# Altium schematic sheet MotorDriver.SchDoc
size A
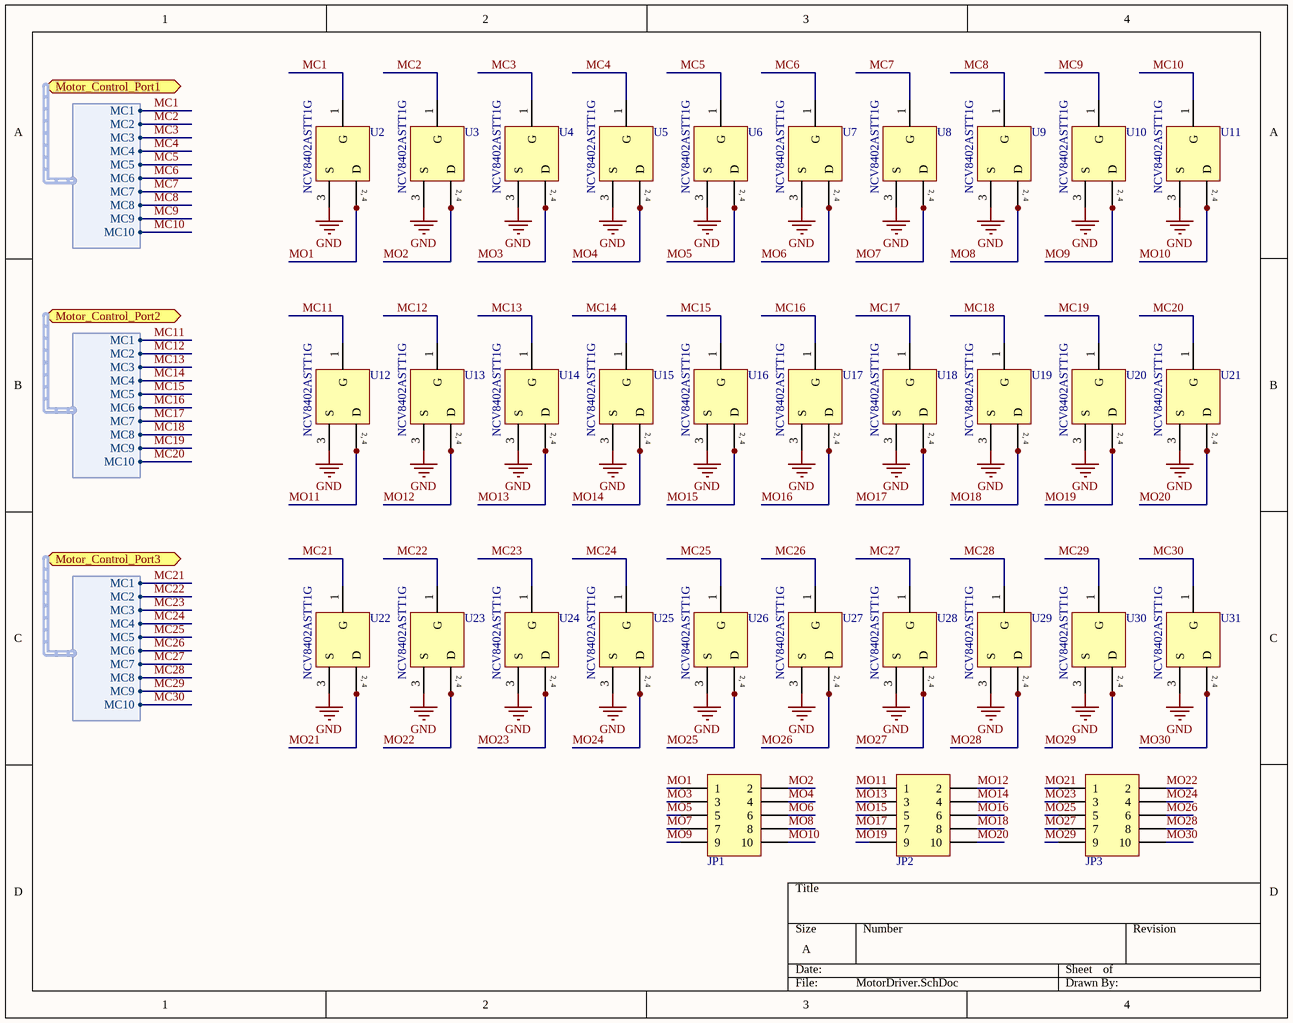
[diagram p0: MotorDriver.SchDoc]

## Parts
JP1  Header 5x2 2.54mm  [2X5]  (value not drawn)
JP2  Header 5x2 2.54mm  [2X5]  (value not drawn)
JP3  Header 5x2 2.54mm  [2X5]  (value not drawn)
U2  NCV8402ASTT1G  [ONSC-SOT-223-4-318E-04_V]
U3  NCV8402ASTT1G  [ONSC-SOT-223-4-318E-04_V]
U4  NCV8402ASTT1G  [ONSC-SOT-223-4-318E-04_V]
U5  NCV8402ASTT1G  [ONSC-SOT-223-4-318E-04_V]
U6  NCV8402ASTT1G  [ONSC-SOT-223-4-318E-04_V]
U7  NCV8402ASTT1G  [ONSC-SOT-223-4-318E-04_V]
U8  NCV8402ASTT1G  [ONSC-SOT-223-4-318E-04_V]
U9  NCV8402ASTT1G  [ONSC-SOT-223-4-318E-04_V]
U10  NCV8402ASTT1G  [ONSC-SOT-223-4-318E-04_V]
U11  NCV8402ASTT1G  [ONSC-SOT-223-4-318E-04_V]
U12  NCV8402ASTT1G  [ONSC-SOT-223-4-318E-04_V]
U13  NCV8402ASTT1G  [ONSC-SOT-223-4-318E-04_V]
U14  NCV8402ASTT1G  [ONSC-SOT-223-4-318E-04_V]
U15  NCV8402ASTT1G  [ONSC-SOT-223-4-318E-04_V]
U16  NCV8402ASTT1G  [ONSC-SOT-223-4-318E-04_V]
U17  NCV8402ASTT1G  [ONSC-SOT-223-4-318E-04_V]
U18  NCV8402ASTT1G  [ONSC-SOT-223-4-318E-04_V]
U19  NCV8402ASTT1G  [ONSC-SOT-223-4-318E-04_V]
U20  NCV8402ASTT1G  [ONSC-SOT-223-4-318E-04_V]
U21  NCV8402ASTT1G  [ONSC-SOT-223-4-318E-04_V]
U22  NCV8402ASTT1G  [ONSC-SOT-223-4-318E-04_V]
U23  NCV8402ASTT1G  [ONSC-SOT-223-4-318E-04_V]
U24  NCV8402ASTT1G  [ONSC-SOT-223-4-318E-04_V]
U25  NCV8402ASTT1G  [ONSC-SOT-223-4-318E-04_V]
U26  NCV8402ASTT1G  [ONSC-SOT-223-4-318E-04_V]
U27  NCV8402ASTT1G  [ONSC-SOT-223-4-318E-04_V]
U28  NCV8402ASTT1G  [ONSC-SOT-223-4-318E-04_V]
U29  NCV8402ASTT1G  [ONSC-SOT-223-4-318E-04_V]
U30  NCV8402ASTT1G  [ONSC-SOT-223-4-318E-04_V]
U31  NCV8402ASTT1G  [ONSC-SOT-223-4-318E-04_V]

## Ports
Motor_Control_Port1 (harness MCP), Motor_Control_Port2 (harness MCP), Motor_Control_Port3 (harness MCP)

## Harnesses
MCP: MC1, MC2, MC3, MC4, MC5, MC6, MC7, MC8, MC9, MC10

## Nets
GND: U2.3(S) U3.3(S) U4.3(S) U5.3(S) U6.3(S) U7.3(S) U8.3(S) U9.3(S) U10.3(S) U11.3(S) U12.3(S) U13.3(S) U14.3(S) U15.3(S) U16.3(S) U17.3(S) U18.3(S) U19.3(S) U20.3(S) U21.3(S) U22.3(S) U23.3(S) U24.3(S) U25.3(S) U26.3(S) U27.3(S) U28.3(S) U29.3(S) U30.3(S) U31.3(S)
MC1: U2.1(G) ; port Motor_Control_Port1.MC1
MC2: U3.1(G) ; port Motor_Control_Port1.MC2
MC3: U4.1(G) ; port Motor_Control_Port1.MC3
MC4: U5.1(G) ; port Motor_Control_Port1.MC4
MC5: U6.1(G) ; port Motor_Control_Port1.MC5
MC6: U7.1(G) ; port Motor_Control_Port1.MC6
MC7: U8.1(G) ; port Motor_Control_Port1.MC7
MC8: U9.1(G) ; port Motor_Control_Port1.MC8
MC9: U10.1(G) ; port Motor_Control_Port1.MC9
MC10: U11.1(G) ; port Motor_Control_Port1.MC10
MC11: U12.1(G) ; port Motor_Control_Port2.MC1
MC12: U13.1(G) ; port Motor_Control_Port2.MC2
MC13: U14.1(G) ; port Motor_Control_Port2.MC3
MC14: U15.1(G) ; port Motor_Control_Port2.MC4
MC15: U16.1(G) ; port Motor_Control_Port2.MC5
MC16: U17.1(G) ; port Motor_Control_Port2.MC6
MC17: U18.1(G) ; port Motor_Control_Port2.MC7
MC18: U19.1(G) ; port Motor_Control_Port2.MC8
MC19: U20.1(G) ; port Motor_Control_Port2.MC9
MC20: U21.1(G) ; port Motor_Control_Port2.MC10
MC21: U22.1(G) ; port Motor_Control_Port3.MC1
MC22: U23.1(G) ; port Motor_Control_Port3.MC2
MC23: U24.1(G) ; port Motor_Control_Port3.MC3
MC24: U25.1(G) ; port Motor_Control_Port3.MC4
MC25: U26.1(G) ; port Motor_Control_Port3.MC5
MC26: U27.1(G) ; port Motor_Control_Port3.MC6
MC27: U28.1(G) ; port Motor_Control_Port3.MC7
MC28: U29.1(G) ; port Motor_Control_Port3.MC8
MC29: U30.1(G) ; port Motor_Control_Port3.MC9
MC30: U31.1(G) ; port Motor_Control_Port3.MC10
MO1: JP1.1 U2.2(D) U2.4(D)
MO2: JP1.2 U3.2(D) U3.4(D)
MO3: JP1.3 U4.2(D) U4.4(D)
MO4: JP1.4 U5.2(D) U5.4(D)
MO5: JP1.5 U6.2(D) U6.4(D)
MO6: JP1.6 U7.2(D) U7.4(D)
MO7: JP1.7 U8.2(D) U8.4(D)
MO8: JP1.8 U9.2(D) U9.4(D)
MO9: JP1.9 U10.2(D) U10.4(D)
MO10: JP1.10 U11.2(D) U11.4(D)
MO11: JP2.1 U12.2(D) U12.4(D)
MO12: JP2.2 U13.2(D) U13.4(D)
MO13: JP2.3 U14.2(D) U14.4(D)
MO14: JP2.4 U15.2(D) U15.4(D)
MO15: JP2.5 U16.2(D) U16.4(D)
MO16: JP2.6 U17.2(D) U17.4(D)
MO17: JP2.7 U18.2(D) U18.4(D)
MO18: JP2.8 U19.2(D) U19.4(D)
MO19: JP2.9 U20.2(D) U20.4(D)
MO20: JP2.10 U21.2(D) U21.4(D)
MO21: JP3.1 U22.2(D) U22.4(D)
MO22: JP3.2 U23.2(D) U23.4(D)
MO23: JP3.3 U24.2(D) U24.4(D)
MO24: JP3.4 U25.2(D) U25.4(D)
MO25: JP3.5 U26.2(D) U26.4(D)
MO26: JP3.6 U27.2(D) U27.4(D)
MO27: JP3.7 U28.2(D) U28.4(D)
MO28: JP3.8 U29.2(D) U29.4(D)
MO29: JP3.9 U30.2(D) U30.4(D)
MO30: JP3.10 U31.2(D) U31.4(D)

## Notes on the sheet
- (in symbol CMP-1069-00019-1) 2, 4

## Library data of the parts
JP1-JP3 = Header 5x2: Header, 8-Pin; Supplier 1: Farnell; Supplier Part Number 1: 1593440
U2-U31 = CMP-1069-00019-1: Self-Protected Low Side Driver with Temperature and Current Limit, 4-Pin SOT-223, Pb-Free, Tape and Reel; Manufacturer: On Semiconductor; Channel Polarity: N Channel; ComponentLink3Description: Package Specification; Packing: Tape and Reel; ComponentLink3URL: http://www.onsemi.com/pub_link/Collateral/318E-04.PDF; ComponentLink1URL: http://www.onsemi.com/; PartNumber: NCV8402ASTT1G; PackageDescription: 4-Pin Small Outline Transistor, Body 6.5 x 3.5 mm, Pitch 2.3 mm; DatasheetVersion: Rev. 8; ComponentLink1Description: Manufacturer URL; Mounting Technology: Surface Mount; PackageVersion: Rev. N, 08/2009; PackageReference: SOT-223-4-318E-04; ComponentLink2URL: http://www.onsemi.com/pub_link/Collateral/NCV8402-D.PDF; ComponentLink2Description: Datasheet; RoHS: Pb-Free